# EAGLE design AvrZiffProgrammer (EAGLE 6.5.0)
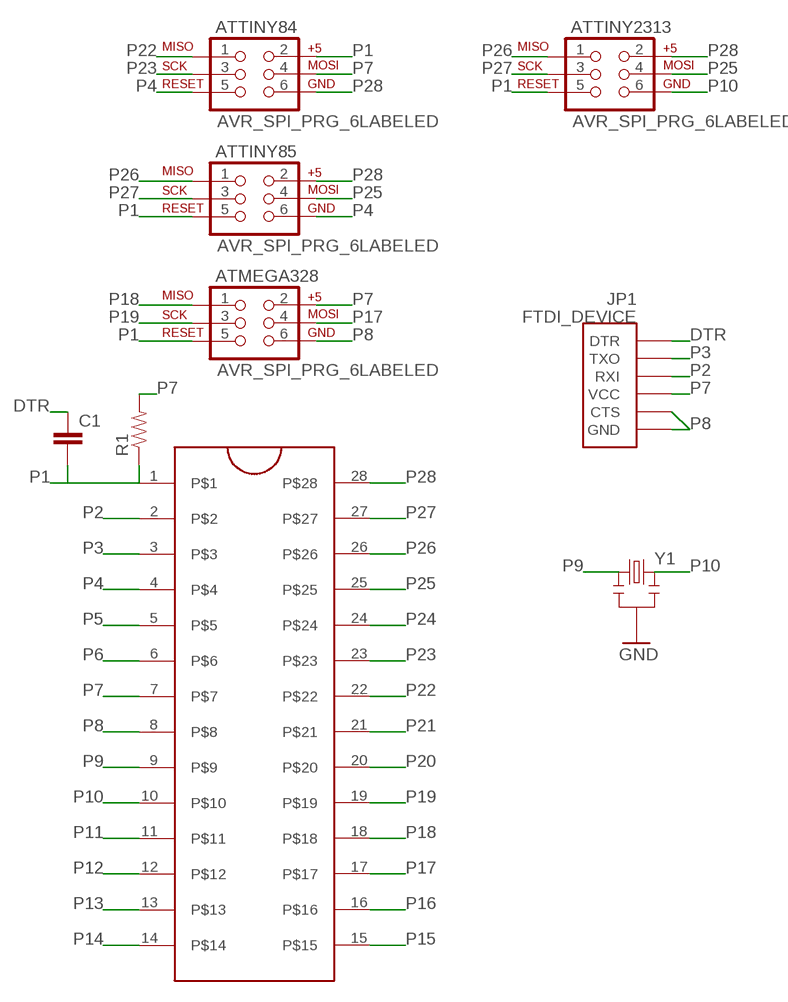
[diagram p0: schematic, sheet 1]

## Parts
ATMEGA328  AVR_SPI_PRG_6LABELED  [2X3-NS]
ATTINY84  AVR_SPI_PRG_6LABELED  [2X3-NS]
ATTINY85  AVR_SPI_PRG_6LABELED  [2X3-NS]
ATTINY2313  AVR_SPI_PRG_6LABELED  [2X3-NS]
C1  CAPPTH  [CAP-PTH-SMALL]
JP1  FTDI_DEVICE  [FTDI_DEVICE_SIDE]
R1  RESISTORAXIAL-0.3  [AXIAL-0.3]
U$1  ZIFSOCKET-28-3ZIFFSOCKET-28-3  [DIL28-3-ZIF_SOCKET]
Y1  RESONATORPTH  [RESONATOR-PTH]

## Nets
DTR: C1.1 JP1.P$1(DTR)
P1: ATMEGA328.5 ATTINY84.2 ATTINY85.5 ATTINY2313.5 C1.2 R1.P$1 U$1.1
P2: JP1.P$3(RXI) U$1.2
P3: JP1.P$2(TXO) U$1.3
P4: ATTINY84.5 ATTINY85.6 U$1.4
P5: U$1.5
P6: U$1.6
P7: ATMEGA328.2 ATTINY84.4 JP1.P$4(VCC) R1.P$2 U$1.7
P8: ATMEGA328.6 JP1.P$5(CTS) JP1.P$6(GND) U$1.8 Y1.2 ; supply symbol labelled GND
P9: U$1.9 Y1.1
P10: ATTINY2313.6 U$1.10 Y1.3
P11: U$1.11
P12: U$1.12
P13: U$1.13
P14: U$1.14
P15: U$1.15
P16: U$1.16
P17: ATMEGA328.4 U$1.17
P18: ATMEGA328.1 U$1.18
P19: ATMEGA328.3 U$1.19
P20: U$1.20
P21: U$1.21
P22: ATTINY84.1 U$1.22
P23: ATTINY84.3 U$1.23
P24: U$1.24
P25: ATTINY85.4 ATTINY2313.4 U$1.25
P26: ATTINY85.1 ATTINY2313.1 U$1.26
P27: ATTINY85.3 ATTINY2313.3 U$1.27
P28: ATTINY84.6 ATTINY85.2 ATTINY2313.2 U$1.28

## Library data of the parts
ATMEGA328 ATTINY84 ATTINY85 ATTINY2313 = barbary_enterprises:AVR_SPI_PRG_6: AVR ISP 6 Pin This is the reduced ISP connector for AVR programming. Common on Arduino. This footprint will take up less PCB space and can be used with a 10-pin to 6-pin adapter such as SKU: BOB-08508
C1 = barbary_enterprises:CAP: Capacitor Standard 0603 ceramic capacitor, and 0.1" leaded capacitor.
JP1 = SparkFun-Connectors:FTDI_DEVICE: Connector which mates to FTDI basic or FTDI cable.
R1 = barbary_enterprises:RESISTOR: Resistor Basic schematic elements and footprints for 0603, 1206, and PTH resistors.
U$1 = SparkFun-Connectors:ZIFSOCKET-28-3: Lever-action ZIF socket for 28-pin ICs
Y1 = SparkFun-FreqCtrl:RESONATOR: Resonator Small SMD resonator. Used, eg, on the Arduino Pro/ Pro Mini boards. 8MHz- XTAL-08895 16MHz- XTAL-08900

## Board
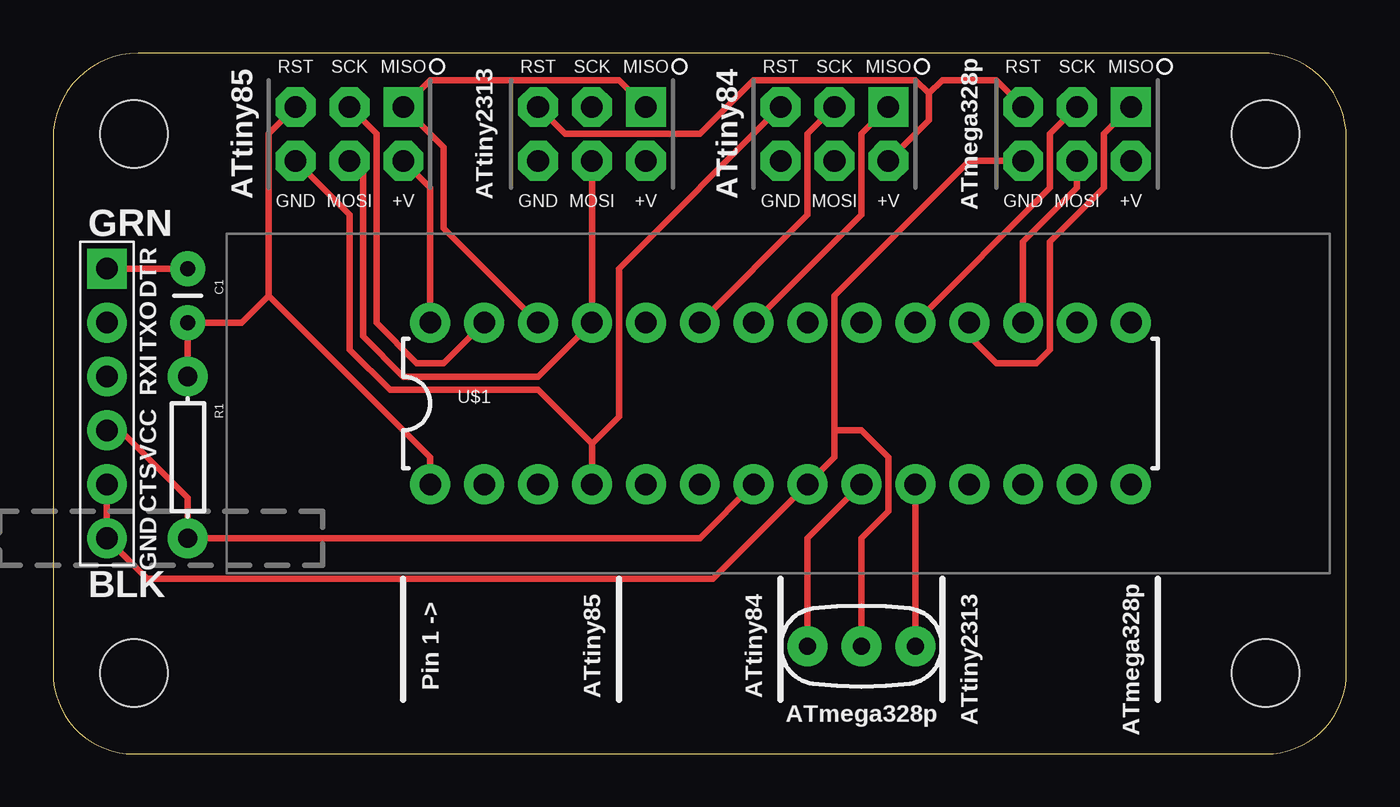
[diagram p1: board, top side]
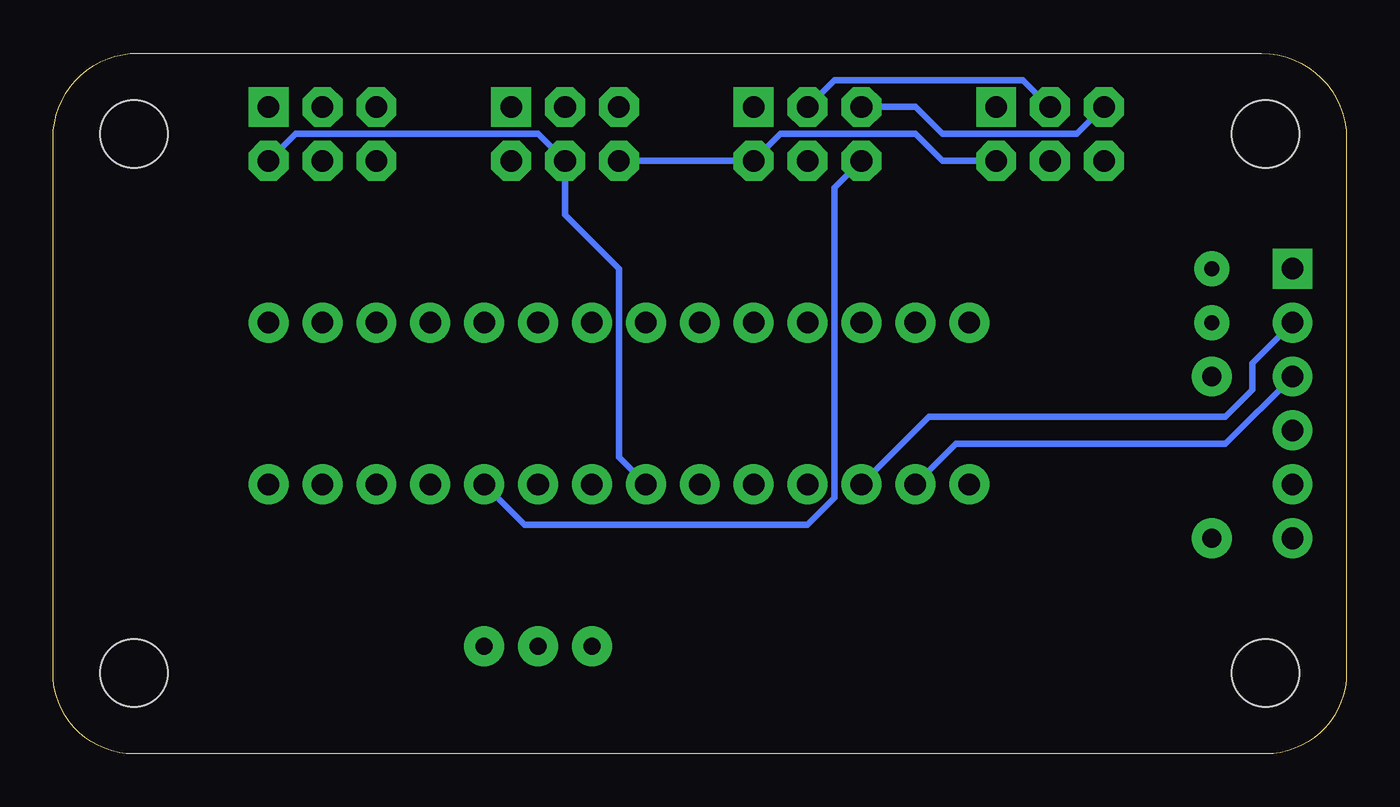
[diagram p2: board, bottom side, seen from below]

Size 60.96 x 33.02 mm. Coordinates in mm from the lower left corner, seen from the top.
Outline: 56.94,33.02 4.01,33.01 arc90 0,29 0,3.81 arc90 3.81,0 57.15,0 arc90 60.96,3.81 60.96,29 arc90 56.94,33.02
Copper layers (1*16): Top 0.0356mm / dielectric 1.5011mm / Bottom 0.0356mm
Design rules "LaenPCBOrder": minimum track width 6mil, minimum drill 13mil, track to track 6mil, track to pad 6mil, pad to pad 6mil, via to via 6mil, smd to smd 6mil, copper to edge 15mil, drill to drill 6mil, minimum pad ring 7mil, minimum via ring 7mil, stop-mask expansion 3mil, vias tented up to drill 0mil, thermal gap 10mil
Holes 3.17 mm at 3.81,3.81 57.15,3.81 3.81,29.21 57.15,29.21

### Footprints (pad centres in the part's own frame; a part is rotated, then mirrored left to right if it is on the bottom)
2X3-NS = drill 1.016 pad 1.88 square: 1 -2.54,-1.27 | drill 1.016 pad 1.88 octagon: 2 -2.54,1.27; 3 0,-1.27; 4 0,1.27; 5 2.54,-1.27; 6 2.54,1.27
CAP-PTH-SMALL = drill 0.7 pad 1.651: 1 0,0; 2 2.54,0
FTDI_DEVICE_SIDE = drill 1.016 pad 1.88 square: P$1 -6.35,0 | drill 1.016 pad 1.88: P$2 -3.81,0; P$3 -1.27,0; P$4 1.27,0; P$5 3.81,0; P$6 6.35,0
AXIAL-0.3 = drill 0.9 pad 1.88: P$1 -3.81,0; P$2 3.81,0
DIL28-3-ZIF_SOCKET = drill 1.016 pad 1.88: 1 -16.51,-3.81; 2 -13.97,-3.81; 3 -11.43,-3.81; 4 -8.89,-3.81; 5 -6.35,-3.81; 6 -3.81,-3.81; 7 -1.27,-3.81; 8 1.27,-3.81; 9 3.81,-3.81; 10 6.35,-3.81; 11 8.89,-3.81; 12 11.43,-3.81; 13 13.97,-3.81; 14 16.51,-3.81; 15 16.51,3.81; 16 13.97,3.81; 17 11.43,3.81; 18 8.89,3.81; 19 6.35,3.81; 20 3.81,3.81; 21 1.27,3.81; 22 -1.27,3.81; 23 -3.81,3.81; 24 -6.35,3.81; 25 -8.89,3.81; 26 -11.43,3.81; 27 -13.97,3.81; 28 -16.51,3.81
RESONATOR-PTH = drill 0.8 pad 1.88: 1 -2.54,0; 2 0,0; 3 2.54,0

### Placement (x,y rotation side)
ATMEGA328  48.26,29.21 180 top
ATTINY84  36.83,29.21 180 top
ATTINY85  13.97,29.21 180 top
ATTINY2313  25.4,29.21 180 top
C1  6.35,22.86 270 top
JP1  2.54,16.51 270 top
R1  6.35,13.97 270 top
U$1  34.29,16.51 0 top
Y1  38.1,5.08 0 top

### Tracks (layer width: path | path; a pad name or v marks a point on that pad's centre or on a via)
DTR
  Top 0.305: JP1.P$1 C1.1
P1
  Top 0.305: U$1.1 17.78,13.97 10.16,21.59 | 10.16,21.59 10.16,29.21 ATTINY85.5 | ATTINY2313.5 24.13,29.21 30.48,29.21 33.02,31.75 40.64,31.75 41.27,31.11 | 41.27,31.11 41.27,29.84 ATTINY84.2 | ATMEGA328.5 44.45,31.75 41.91,31.75 41.27,31.11 | R1.P$1 C1.2 8.89,20.32 10.16,21.59
  Bottom 0.305: ATTINY2313.5 20.32,30.48 19.05,29.21 12.7,29.21 ATTINY85.5
P2
  Bottom 0.305: JP1.P$3 5.71,14.61 18.41,14.61 U$1.2
P3
  Bottom 0.305: JP1.P$2 4.45,18.41 4.45,17.14 5.71,15.88 19.68,15.88 U$1.3
P4
  Top 0.305: U$1.4 25.4,14.61 | 25.4,14.61 22.86,17.14 15.88,17.14 13.97,19.05 13.97,25.4 ATTINY85.6 | ATTINY84.5 26.67,22.86 26.67,15.88 25.4,14.61
P7
  Top 0.305: JP1.P$4 3.17,15.24 6.35,12.06 R1.P$2 30.48,10.16 U$1.7
  Bottom 0.305: U$1.7 34.29,13.97 34.29,22.86 36.83,25.4 ATTINY84.4 38.1,29.21 49.53,29.21 ATMEGA328.2
P8
  Top 0.305: ATMEGA328.6 43.18,27.94 36.83,21.59 36.83,15.24 | 36.83,15.24 36.83,13.97 U$1.8 31.11,8.26 4.45,8.26 JP1.P$6 JP1.P$5 | Y1.2 38.1,10.16 39.37,11.43 39.37,13.97 38.1,15.24 36.83,15.24
P9
  Top 0.305: Y1.1 35.56,10.16 U$1.9
P10
  Top 0.305: Y1.3 U$1.10
  Bottom 0.305: ATTINY2313.6 24.13,26.67 24.13,12.06 25.4,10.79 38.73,10.79 U$1.10
P17
  Top 0.305: U$1.17 45.72,24.13 48.26,26.67 ATMEGA328.4
P18
  Top 0.305: U$1.18 43.18,19.68 44.45,18.41 46.35,18.41 46.99,19.05 46.99,24.13 49.53,26.67 49.53,29.21 ATMEGA328.1
P19
  Top 0.305: U$1.19 46.99,26.67 46.99,29.21 ATMEGA328.3
P22
  Top 0.305: ATTINY84.1 38.1,29.21 38.1,25.4 U$1.22
P23
  Top 0.305: ATTINY84.3 35.56,29.21 35.56,25.4 U$1.23
P25
  Top 0.305: ATTINY85.4 14.61,27.3 14.61,19.68 16.51,17.78 22.86,17.78 U$1.25 ATTINY2313.4
P26
  Top 0.305: U$1.26 18.41,24.77 18.41,28.57 ATTINY85.1 17.78,31.75 26.67,31.75 ATTINY2313.1
P27
  Top 0.305: U$1.27 18.41,18.41 17.14,18.41 15.24,20.32 15.24,29.21 ATTINY85.3
  Bottom 0.305: ATTINY2313.3 24.13,31.75 15.24,31.75 ATTINY85.3
P28
  Top 0.305: U$1.28 17.78,26.67 ATTINY85.2
  Bottom 0.305: ATTINY85.2 19.05,27.94 20.32,29.21 26.67,29.21 ATTINY2313.2 ATTINY84.6

### Text on the board
tPlace: ATtiny85 | ATtiny2313 | ATtiny84 | ATmega328p | Pin 1 -> | ATtiny85 | ATtiny84 | ATtiny2313 | ATmega328p | ATmega328p